# Altium schematic sheet PowerSupply.SchDoc
size A4
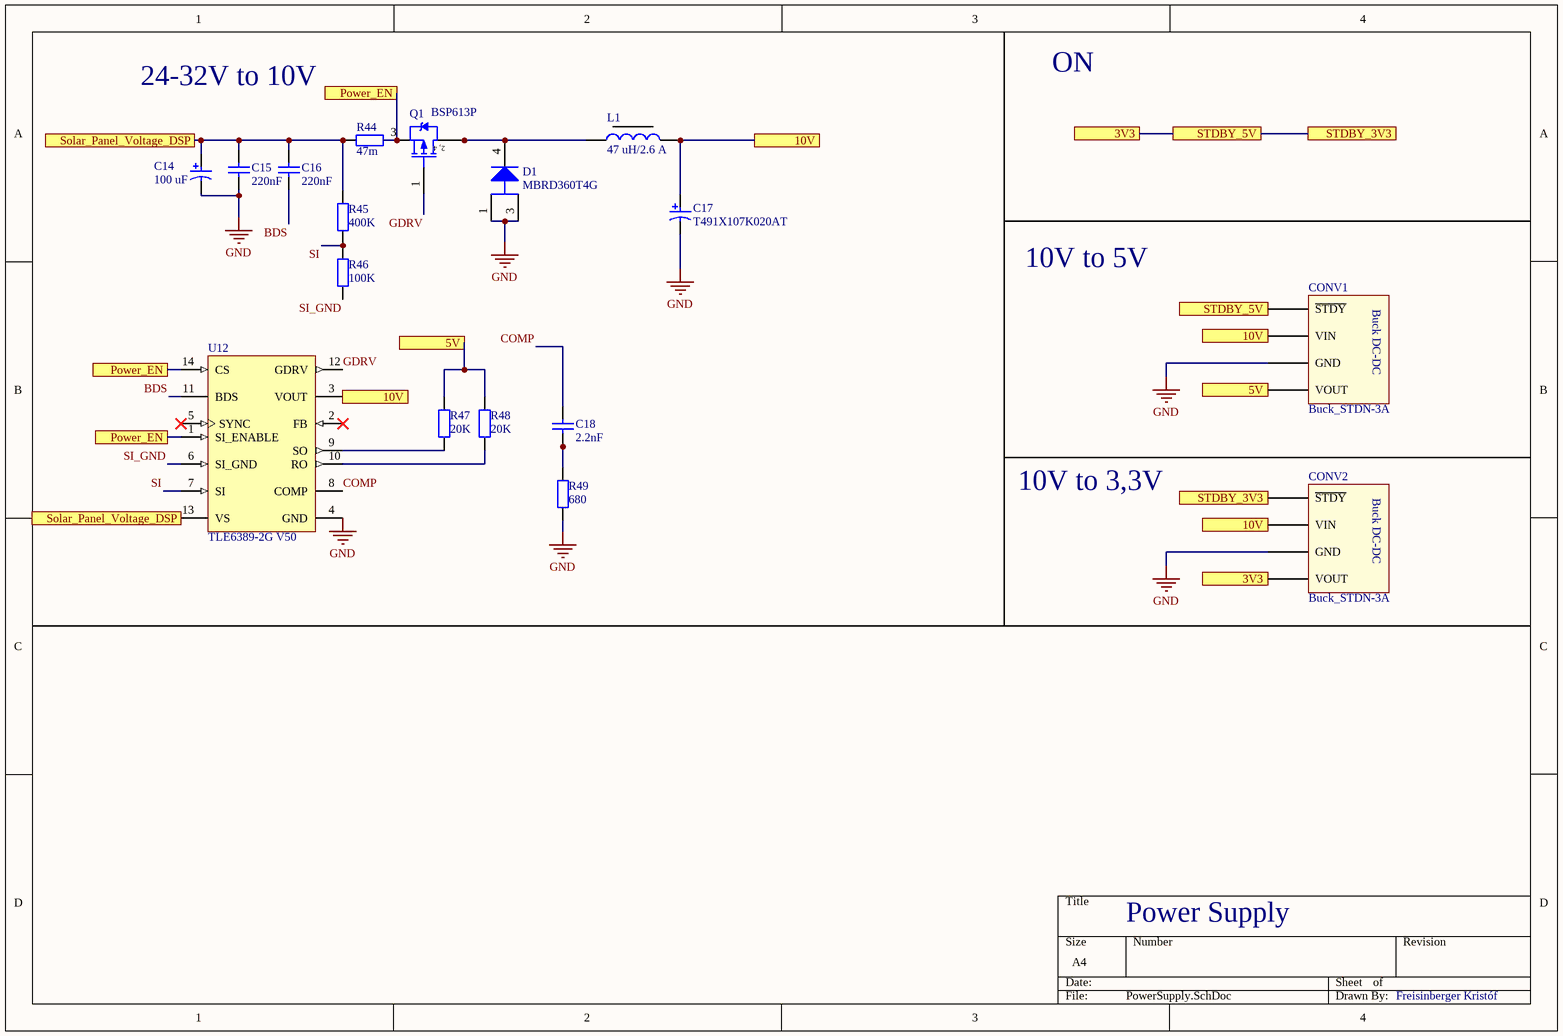
[diagram p0: PowerSupply.SchDoc]

## Parts
C14  100 uF  [NIC-UVR-10x12.5-2_V]
C15  220nF  [FP_0805_CAP_085]
C16  220nF  [FP_0805_CAP_085]
C17  T491X107K020AT  [KEMT-7343-43_L]
C18  2.2nF  [FP_0805_CAP_085]
CONV1  Buck_STDN-3A  [Buck_STDN-3A24-ADJ]
CONV2  Buck_STDN-3A  [Buck_STDN-3A24-ADJ]
D1  MBRD360T4G  [ONSC-DPAK-3-369C-01_V]
L1  47 uH/2.6 A  [Tekercs_B82479-A1473-M - duplicate]
Q1  BSP613P  [INF-PG-SOT223_SC-73_M]
R44  47m  [FP_0805_RES]
R45  400K  [FP_0805_RES]
R46  100K  [FP_0805_RES]
R47  20K  [FP_0805_RES]
R48  20K  [FP_0805_RES]
R49  680  [FP_0805_RES]
U12  TLE6389-2G V50  [INF-PG-DSO-14-1_M]

## Ports
3V3, 5V, 10V, Power_EN, Solar_Panel_Voltage_DSP, STDBY_3V3, STDBY_5V

## Nets
GND: C14.2 C15.1 C17.2 CONV1.3(GND) CONV2.3(GND) D1.1(A) D1.3(A) R49.1 U12.4(GND)
3V3: CONV1.1(~{STDY}) CONV2.1(~{STDY}) CONV2.4(VOUT) ; port STDBY_5V, port STDBY_3V3, port 3V3
5V: CONV1.4(VOUT) R47.2 R48.2 ; port 5V
10V: C17.1 CONV1.2(VIN) CONV2.2(VIN) L1.2(Out) U12.3(VOUT) ; port 10V
BDS: C16.1 U12.11(BDS)
COMP: C18.2 U12.8(COMP)
GDRV: Q1.1(GATE) U12.12(GDRV)
Power_EN: Q1.3(SOURCE) R44.1 U12.1(SI_ENABLE) U12.14(CS) ; port Power_EN
SI: R45.1 R46.2 U12.7(SI)
SI_GND: R46.1 U12.6(SI_GND)
Solar_Panel_Voltage_DSP: C14.1 C15.2 C16.2 R44.2 R45.2 U12.13(VS) ; port Solar_Panel_Voltage_DSP
NetC18_1: C18.1 R49.2
NetD1_4: D1.4(K) L1.1(In) Q1.2(DRAIN) Q1.4(DRAIN)
NetR47_1: R47.1 U12.9(SO)
NetR48_1: R48.1 U12.10(RO)

Not connected (* = marked no-connect by the designer): U12 2(FB)* 5(SYNC)*

## Notes on the sheet
- 24-32V to 10V
- ON
- 10V to 5V
- 10V to 3,3V
- Power Supply
- Freisinberger Kristóf
- (in symbol Buck_STDN-3A) Buck DC-DC
- (in symbol CMP-1099-00021-1) 2, 4

## Library data of the parts
C14 = CMP-1217-00001-1: Aluminum Electrolytic Capacitor, 63 V, -40 to 85 degC, 2-Pin CAP, RoHS; Manufacturer: Nichicon; PartNumber: UVR1J101MPD1TD; Capacitance Tolerance: +/-20%; Rated Voltage: 63 V; Packing: Bulk; Rated Ripple@85 degC 120 Hz: 300 mA; ComponentLink3URL: https://il.farnell.com/teapo/ksy107m063s1g5h1ck/cap-100-f-63v-20/dp/2901348?st=100%20uf%20electrolyte%20capacitor; ComponentLink2Description: Datasheet; Operating Temperature: -40 to 85 degC; PackageDescription: 2-Pin Through Hole Package, Dia 10 mm, Body Length 12.5 mm, Pitch 5 mm; Mounting Technology: Through Hole; ComponentLink3Description: Package Specification; RoHS: TRUE; DatasheetVersion: Sep-13; ComponentLink1Description: Manufacturer URL; ComponentLink2URL: https://il.farnell.com/teapo/ksy107m063s1g5h1ck/cap-100-f-63v-20/dp/2901348?st=100%20uf%20electrolyte%20capacitor; Rated Capacitance: 100 uF; ComponentLink1URL: http://www.nichicon.co.jp/
C15 C16 C18 = CAP: Capacitor
  C15 C16: Value: 220nF
  C18: Value: 2.2nF
C17 = CMP-2000-07204-1: Tantalum Surface Mount Capacitor, 100 uF, 25 V, -55 to 125 degC, 2-Pin Molded, RoHS, Tape and Reel; Manufacturer: Kemet; Manufacturer Size Code: X; ESR (Equivalent Series Resistance): 300mOhm; Tolerance: ±10%; Capacitance: 100µF; Voltage - Rated: 25V; Product Training Modules: CapacitorBasics-TypicalUsesforCapacitors; Other Names: 399-8410-6; Lifetime @ Temp.: 2000Hrs@85°C; Online Catalog: T491Series; EDA / CAD Models: DownloadfromAcceleratedDesigns; Mounting Type: SurfaceMount; Series: T491; Packaging: Digi-Reel®; Category: Capacitors; Family: TantalumCapacitors; Manufacturer URL: http://www.kemet.com/; Datasheet URL: https://ciiva.com/datasheet-click-3798150?src=ciiva&sig=eb1f20b4; Mounting Technology: SurfaceMount; Lead Spacing: -; Datasheet Version: 12/2015; Standard Package: 1; Type: Molded; Features: GeneralPurpose; Package Description: 2-Pin Molded Capacitor, Body 7.3 x 4.3 mm; Size / Dimension: 0.287"Lx0.169"W(7.30mmx4.30mm); Package Reference: Molded; Height - Seated (Max): 0.169"(4.30mm); Package / Case: 2917(7343Metric); Operating Temperature: -55°C~125°C
D1 = CMP-1055-00192-1: SWITCHMODE(TM) Power Rectifier, 3-Pin DPAK, Pb-Free, Tape and Reel; Manufacturer: On Semiconductor; Configuration: Single; IFSM Max (A): 75; Mounting Technology: Surface Mount; ComponentLink2Description: Datasheet; ComponentLink3URL: http://www.onsemi.cn/pub_link/Collateral/369C.PDF; DatasheetVersion: Rev. 8; ComponentLink2URL: http://www.onsemi.com/pub_link/Collateral/MBRD320-D.PDF; PackageDescription: 3-Pin Flange Mount, Body 6.54 x 6.095 mm, Pitch 2.29 mm; ComponentLink1URL: http://www.onsemi.com/; Packing: Tape and Reel; RoHS: TRUE; ComponentLink1Description: Manufacturer URL; ComponentLink3Description: Package Specification; PackageVersion: Rev. E, 02/2014; PackageReference: DPAK-3-369C-01; PartNumber: MBRD360T4G
L1 = Inductor_B82479A1473M000: Inductor Power Wirewound 47uH 20% 100KHz Ferrite 2.6A 87mOhm DCR Automotive T/R; Manufacturer: TDK EPCOS; Saturation Current: 4.5A; Shielding: Unshielded; DC Resistance (DCR): 87mR; Inductor Type: POWER INDUCTOR; Supplier 1: Farnell; Manufacturer Part Number: B82479A1473M000; RoHS: Yes; Category: Fixed Inductors; Stock 1: 25; Mount: Surface Mount; Case/Package: SMD/SMT; Number of Pins: 2; Core Material: Ferrite; Weight: 0.105822oz; Min Operating Temperature: -55°C; Max Operating Temperature: 150°C; Package Quantity: 250; Current Rating: 2.6A; Tolerance: 20%; Packaging: Tape and Reel; Inductance Tolerance: 20%; Self Resonant Frequency: 100kHz; Inductance: 47uH; Test Frequency: 100kHz; Max DC Current: 2.6A; Termination: SMD/SMT; RMS Current (Irms): 2.6A; DC Current: 2.6A; Series: B82479A1; Length: 18.54mm; Width: 0.6inch; Height: 7.11mm; Depth: 15.24mm; REACH SVHC: No SVHC; Military Standard: Not; Lead Free: Lead Free; RoHS Compliant: Yes; ComponentLink1URL: https://datasheet.ciiva.com/6692/b82479a1-6692885.pdf?src-supplier=Digi-Key; ComponentLink1Description: https://datasheet.ciiva.com/6692/b82479a1-6692885.pdf?src-supplier=Digi-Key; ComponentLink2URL: https://datasheet.ciiva.com/22683/1899175-22683671.pdf?src-supplier=Element14; ComponentLink2Description: https://datasheet.ciiva.com/22683/1899175-22683671.pdf?src-supplier=Element14; ComponentLink3URL: https://datasheet.ciiva.com/22683/1899175-22683672.pdf?src-supplier=Element14; ComponentLink3Description: https://datasheet.ciiva.com/22683/1899175-22683672.pdf?src-supplier=Element14; ComponentLink4URL: https://datasheet.ciiva.com/28652/b82479a1-28652056.pdf?src-supplier=Element14; ComponentLink4Description: https://datasheet.ciiva.com/28652/b82479a1-28652056.pdf?src-supplier=Element14
Q1 = CMP-1099-00021-1: P-Channel SIPMOS Small-Signal-Transistor, -60 V VDS, -2.9 A ID, -55 to 150 degC, PG-SOT223 (SC-73), Reel, Green; Manufacturer: Infineon; VDS (max): -60Â V; ID (max): -2.9Â A; QG: -22Â nC; VGS(th) (max): -4Â V; Rth: 100Â K/W; Polarity: P; VGS(th) (min): -2.1Â V; IDpuls (max): -11.6Â A; Mode: Enhancement; RDS (on) (max): 130Â mOhm; Pto t (max): 1.8Â W; Green: TRUE; ComponentLink2Description: Datasheet; DatasheetVersion: Rev. 2.7; ComponentLink3URL: http://www.infineon.com/dgdl/SOT223-Package_Overview.pdf?folderId=db3a30431936bc4b0119530470b03c3d&fileId=db3a30431936bc4b0119531d40b93c5c; Packing: Reel; Halogen-free: TRUE; PackageReference: PG-SOT223 (SC-73); PackageVersion: Apr-08; PackageDescription: 4-Pin Small Outline Transistor Package, 6.5 x 3.5 mm Body, 2.3 mm Pitch; ComponentLink2URL: http://www.infineon.com/dgdl/BSP613P_Rev2.7.pdf?folderId=db3a304314dca38901154a72e3951a65&fileId=db3a30433b47825b013b60ac86a96dc0; ComponentLink1Description: Manufacturer URL; ComponentLink3Description: Package Specification; Mounting Technology: Surface Mount; Technology: SIPMOS; PartNumber: BSP613P; ComponentLink1URL: http://www.infineon.com/
R44-R49 = RES: Resistor
  R44: Value: 47m
  R45: Value: 400K
  R46: Value: 100K
  R47 R48: Value: 20K
  R49: Value: 680
U12 = CMP-1093-00004-1: Step-Down DC/DC Controller, -40 to 150 degC, PG-DSO-14-1, Reel, Green; Manufacturer: Infineon; Output: Buck Converter; Iq (typ): 130 uA; VQ (max): 5V; Tolerance: 3%; Green: TRUE; IQ (max): 2,300 mA; ComponentLink1URL: http://www.infineon.com/; ComponentLink3URL: http://www.infineon.com/dgdl/DCDC-Controller-IFX80471-Data-Sheet-V10-Infineon.pdf?folderId=db3a304314dca3890115039cf70d0bf0&fileId=db3a30432e398416012e487ec6e42599; PartNumber: TLE6389-2G V50; PackageVersion: Apr-11; ComponentLink3Description: Package Specification; DatasheetVersion: Rev. 2.1; PackageReference: PG-DSO-14-1; PackageDescription: 14-Pin Plastic (Green) Dual Small Outline Package, 8.65 x 3.9 mm Body, 1.27 mm Pitch; ComponentLink2URL: http://www.infineon.com/dgdl/TLE6389-2-3_DS_21.pdf?folderId=db3a304412b407950112b408e8c90004&fileId=db3a304412b407950112b43641bf65a6&location=en.Products.Power_Management_ICs.DC_DC.DC_DC-Converter__Automotive_.DATASHEET.TLE6389-2-3_DS_21.pdf; Halogen-free: TRUE; ComponentLink1Description: Manufacturer URL; Packing: Reel; Mounting Technology: Surface Mount; ComponentLink2Description: Datasheet